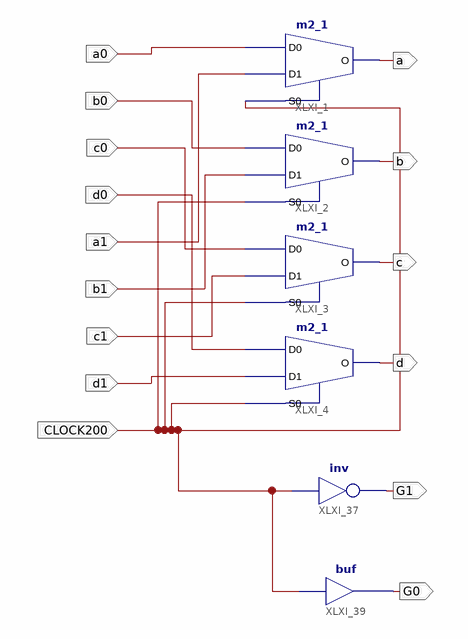
[diagram p0: schematic sheet 1]
// Xilinx ISE schematic multiplexer.sch (spartan6) as structural Verilog: 6 symbols, 15 ports
module multiplexer (
  input  a0,
  input  b0,
  input  c0,
  input  d0,
  input  a1,
  input  b1,
  input  c1,
  input  d1,
  input  CLOCK200,
  output a,
  output b,
  output c,
  output d,
  output G1,
  output G0
);

  m2_1 XLXI_1 (.D0(a0), .D1(a1), .S0(CLOCK200), .O(a));
  m2_1 XLXI_2 (.D0(b0), .D1(b1), .S0(CLOCK200), .O(b));
  m2_1 XLXI_3 (.D0(c0), .D1(c1), .S0(CLOCK200), .O(c));
  m2_1 XLXI_4 (.D0(d0), .D1(d1), .S0(CLOCK200), .O(d));
  not XLXI_37 (G1, CLOCK200);
  buf XLXI_39 (G0, CLOCK200);
endmodule
